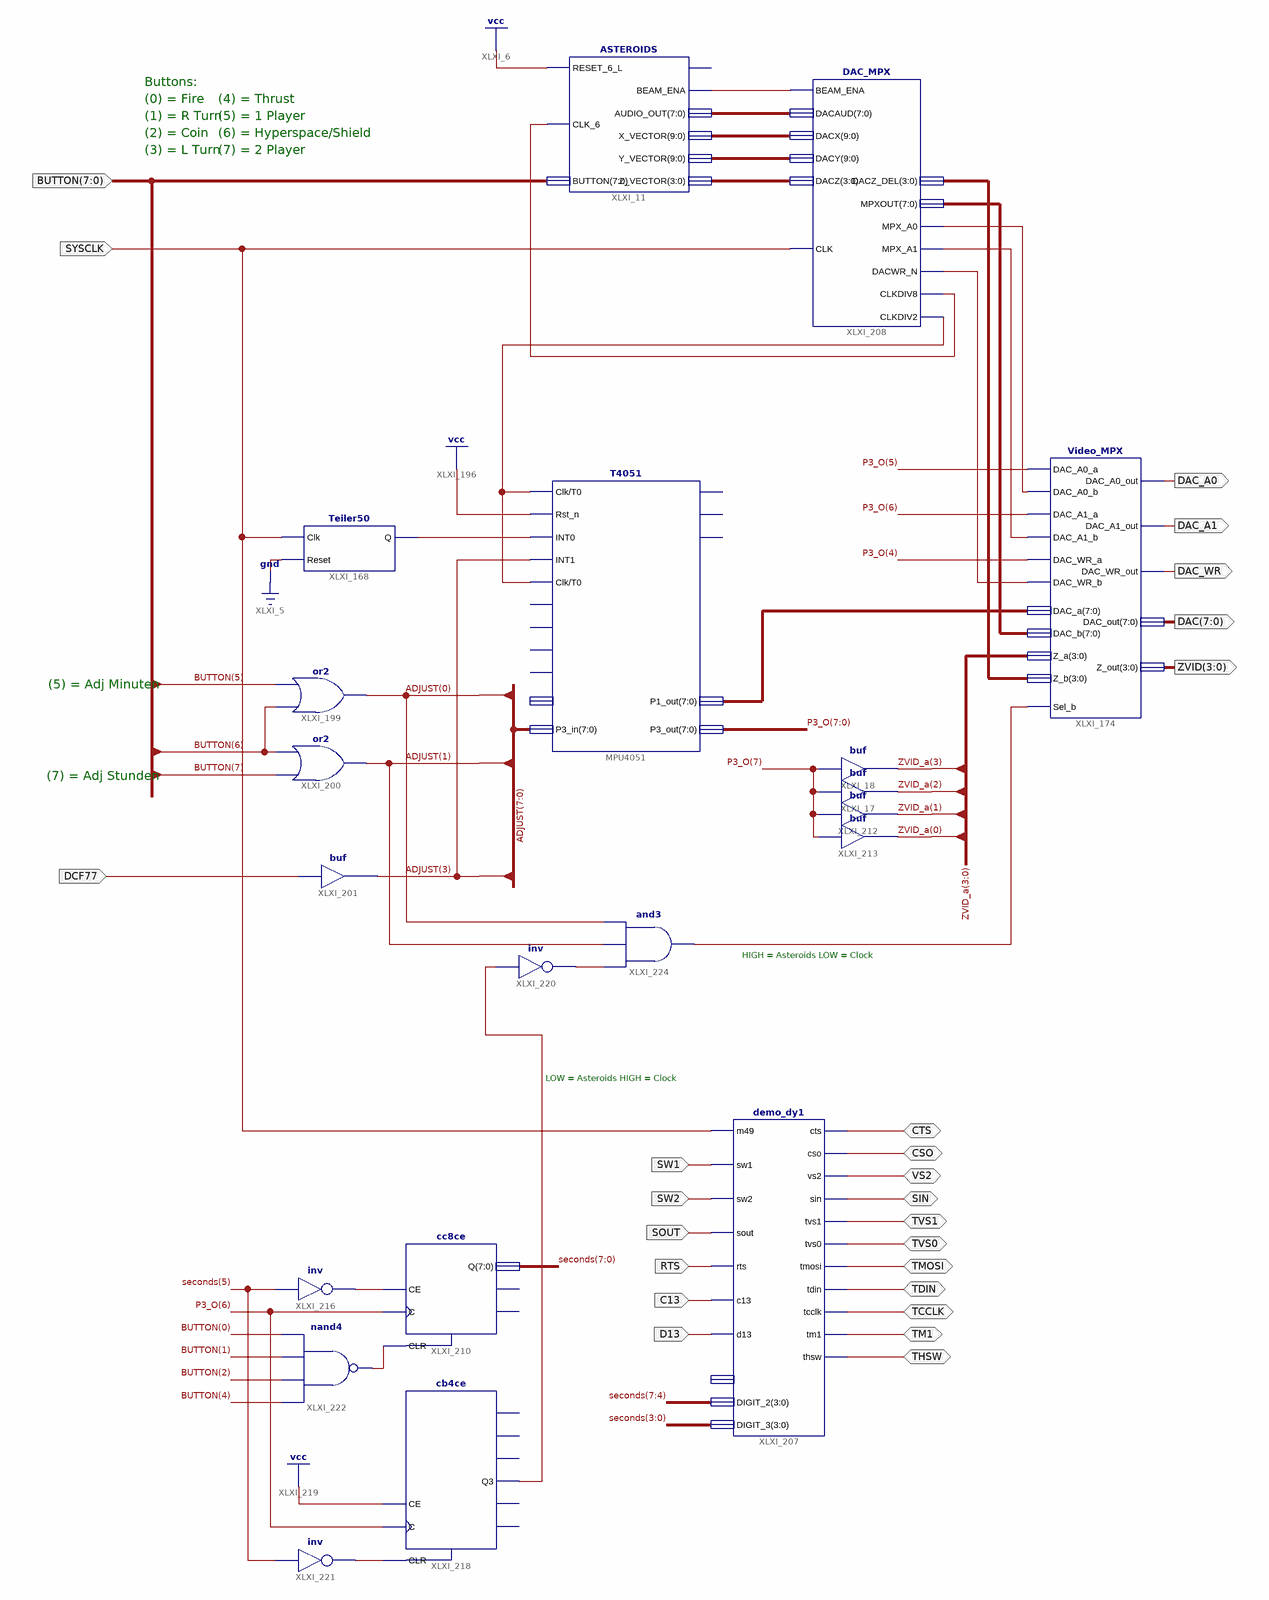
[diagram p0: schematic sheet 1]
// Xilinx ISE schematic AsteroidsClock_top.sch (spartan3e) as structural Verilog: 20 symbols, 25 ports
module AsteroidsClock_top (
  input  SYSCLK,
  input  [7:0] BUTTON,
  input  DCF77,
  input  SW1,
  input  SW2,
  input  SOUT,
  input  RTS,
  input  C13,
  input  D13,
  inout  THSW,
  inout  TM1,
  inout  TCCLK,
  inout  TDIN,
  inout  TMOSI,
  inout  TVS0,
  inout  TVS1,
  inout  CTS,
  inout  CSO,
  inout  VS2,
  inout  SIN,
  output [3:0] ZVID,
  output DAC_A1,
  output DAC_A0,
  output DAC_WR,
  output [7:0] DAC
);

  wire XLXN_94, XLXN_156, XLXN_162, XLXN_163, XLXN_164, XLXN_166, XLXN_173, XLXN_201, XLXN_203, XLXN_204,
       XLXN_209, XLXN_220, XLXN_221;
  wire [3:0] XLXN_148, XLXN_169, ZVID_a;
  wire [7:0] ADJUST, DAC_a, DAC_b, DACAUDIO, P3_O, seconds;
  wire [9:0] DACX, DACY;

  ASTEROIDS XLXI_11 (
    .RESET_6_L(1'b1), .CLK_6(XLXN_156), .BUTTON(BUTTON), .BEAM_ENA(XLXN_173), .AUDIO_OUT(DACAUDIO),
    .X_VECTOR(DACX), .Y_VECTOR(DACY), .Z_VECTOR(XLXN_148));  // open: BEAM_ON
  Teiler50 XLXI_168 (.Clk(SYSCLK), .Reset(1'b0), .Q(XLXN_94));
  T4051 MPU4051 (
    .Clk(XLXN_166), .Rst_n(1'b1), .INT0(XLXN_94), .INT1(ADJUST[3]), .T0(XLXN_166), .P3_in(ADJUST),
    .P1_out(DAC_a), .P3_out(P3_O));  // open: T1, T2, T2EX, P1_in, RXD_IsO, RXD_O, TXD, RXD
  Video_MPX XLXI_174 (
    .DAC_A0_a(P3_O[5]), .DAC_A0_b(XLXN_162), .DAC_A1_a(P3_O[6]), .DAC_A1_b(XLXN_163), .DAC_WR_a(P3_O[4]),
    .DAC_WR_b(XLXN_164), .Sel_b(XLXN_221), .DAC_a(DAC_a), .DAC_b(DAC_b), .Z_a(ZVID_a), .Z_b(XLXN_169),
    .DAC_A0_out(DAC_A0), .DAC_A1_out(DAC_A1), .DAC_WR_out(DAC_WR), .DAC_out(DAC), .Z_out(ZVID));
  buf XLXI_18 (ZVID_a[3], P3_O[7]);
  buf XLXI_17 (ZVID_a[2], P3_O[7]);
  or XLXI_199 (ADJUST[0], BUTTON[6], BUTTON[5]);
  or XLXI_200 (ADJUST[1], BUTTON[7], BUTTON[6]);
  buf XLXI_201 (ADJUST[3], DCF77);
  DAC_MPX XLXI_208 (
    .CLK(SYSCLK), .DACX(DACX), .DACY(DACY), .DACZ(XLXN_148), .DACAUD(DACAUDIO), .MPX_A0(XLXN_162),
    .MPX_A1(XLXN_163), .DACWR_N(XLXN_164), .CLKDIV2(XLXN_166), .CLKDIV8(XLXN_156), .MPXOUT(DAC_b),
    .DACZ_DEL(XLXN_169), .BEAM_ENA(XLXN_173));
  buf XLXI_212 (ZVID_a[1], P3_O[7]);
  buf XLXI_213 (ZVID_a[0], P3_O[7]);
  not XLXI_220 (XLXN_220, XLXN_203);
  and XLXI_224 (XLXN_221, XLXN_220, ADJUST[1], ADJUST[0]);
  demo_dy1 XLXI_207 (
    .m49(SYSCLK), .sw1(SW1), .sw2(SW2), .sout(SOUT), .rts(RTS), .c13(C13), .d13(D13), .cts(CTS), .cso(CSO),
    .vs2(VS2), .sin(SIN), .tvs1(TVS1), .tvs0(TVS0), .tmosi(TMOSI), .tdin(TDIN), .tcclk(TCCLK), .tm1(TM1),
    .thsw(THSW), .DIGIT_2(seconds[7:4]), .DIGIT_3(seconds[3:0]));  // open: DIGIT_1
  cc8ce XLXI_210 (.C(P3_O[6]), .CE(XLXN_201), .CLR(XLXN_209), .Q(seconds));  // open: CEO, TC
  not XLXI_216 (XLXN_201, seconds[5]);
  cb4ce XLXI_218 (.C(P3_O[6]), .CE(1'b1), .CLR(XLXN_204), .Q3(XLXN_203));  // open: CEO, Q0, Q1, Q2, TC
  not XLXI_221 (XLXN_204, seconds[5]);
  nand XLXI_222 (XLXN_209, BUTTON[4], BUTTON[2], BUTTON[1], BUTTON[0]);

  // Notes on the sheet:
  //   Buttons:
  //   (0) = Fire
  //   (4) = Thrust
  //   (1) = R Turn
  //   (5) = 1 Player
  //   (2) = Coin
  //   (6) = Hyperspace/Shield
  //   (3) = L Turn
  //   (7) = 2 Player
  //   (5) = Adj Minuten
  //   (7) = Adj Stunden
  //   HIGH = Asteroids LOW = Clock
  //   LOW = Asteroids HIGH = Clock
endmodule
